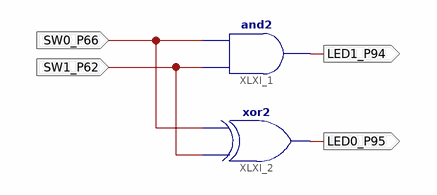
[diagram p0: schematic sheet 1]
// Xilinx ISE schematic HalfAdder.sch (spartan6) as structural Verilog: 2 symbols, 4 ports
module HalfAdder (
  input  SW0_P66,
  input  SW1_P62,
  output LED1_P94,
  output LED0_P95
);

  and XLXI_1 (LED1_P94, SW1_P62, SW0_P66);
  xor XLXI_2 (LED0_P95, SW1_P62, SW0_P66);
endmodule
